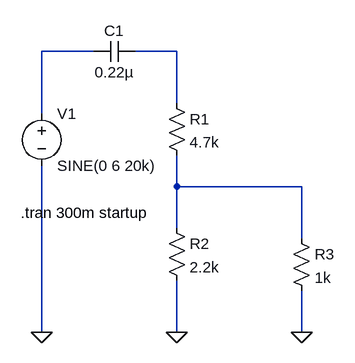
[diagram p0: schematic voltage divider 2.asc]
voltage divider 2.asc, the LTspice schematic file:
Version 4
SHEET 1 880 680
WIRE 128 80 48 80
WIRE 256 80 192 80
WIRE 256 160 256 80
WIRE 48 176 48 80
WIRE 256 288 256 240
WIRE 448 288 256 288
WIRE 256 352 256 288
WIRE 448 368 448 288
WIRE 48 512 48 256
WIRE 256 512 256 432
WIRE 448 512 448 448
FLAG 48 512 0
FLAG 256 512 0
FLAG 448 512 0
SYMBOL cap 128 96 R270
WINDOW 0 32 32 VTop 2
WINDOW 3 0 32 VBottom 2
SYMATTR InstName C1
SYMATTR Value 0.22µ
SYMBOL res 240 144 R0
SYMATTR InstName R1
SYMATTR Value 4.7k
SYMBOL voltage 48 160 R0
WINDOW 123 0 0 Left 0
WINDOW 39 0 0 Left 0
SYMATTR InstName V1
SYMATTR Value SINE(0 6 20k)
SYMBOL res 240 336 R0
SYMATTR InstName R2
SYMATTR Value 2.2k
SYMBOL res 432 352 R0
SYMATTR InstName R3
SYMATTR Value 1k
TEXT 16 328 Left 2 !.tran 300m startup

The netlist it stands for:
* voltage divider 2.asc
C1 N001 N002 0.22µ
R1 N002 N003 4.7k
V1 N001 0 SINE(0 6 20k)
R2 N003 0 2.2k
R3 N003 0 1k
.tran 300m startup
.backanno
.end